# EAGLE schematic nixiRemoteControlReceiver (EAGLE 7.2.0)
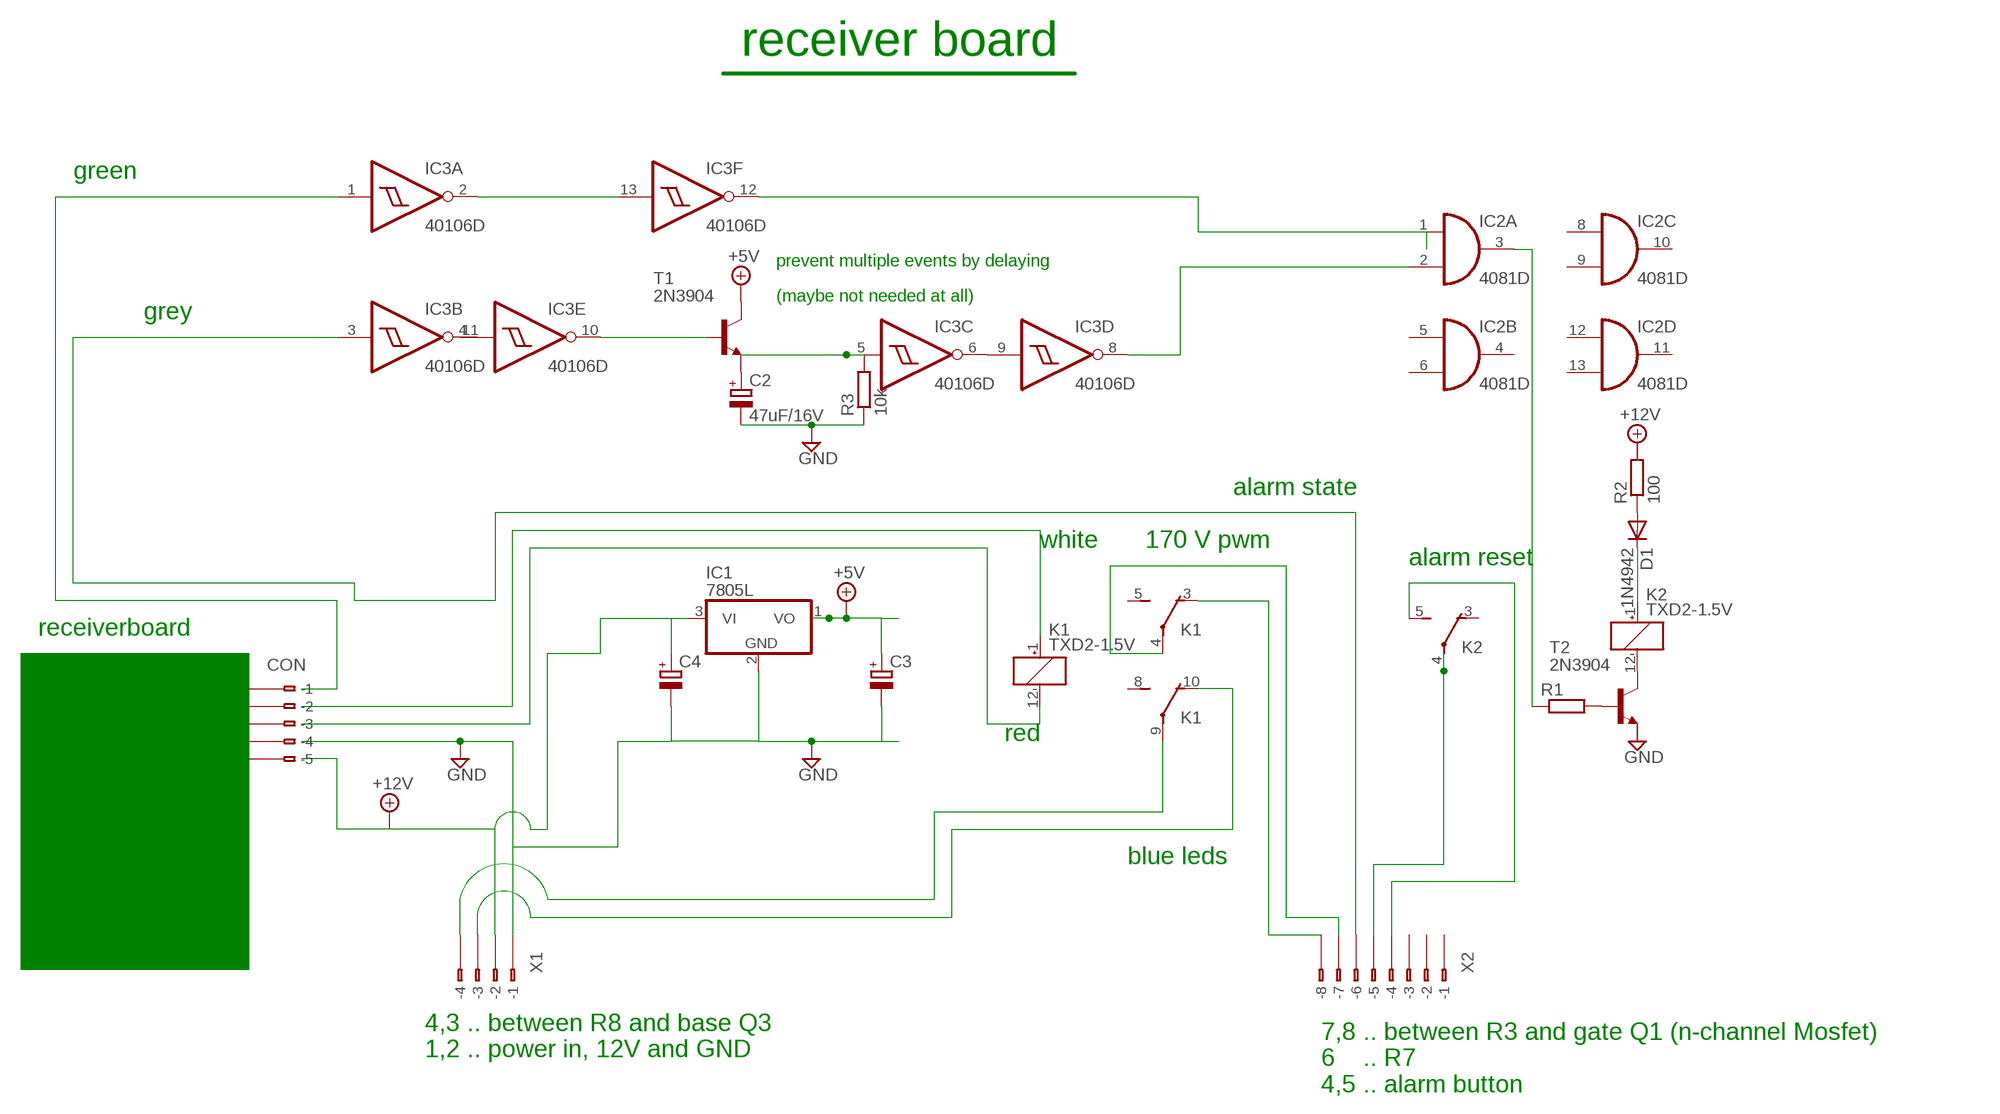
[diagram p0: schematic, sheet 1]

## Parts
C2  47uF/16V  CPOL-EUE10-20  [EB20D]
C3  CPOL-EUE10-20  [EB20D]
C4  CPOL-EUE10-20  [EB20D]
CON  233-105  [233-105]
D1  1N4942  [DO41-10]
IC1  7805L  [TO92]
IC2  4081D  [SO14]
IC3  40106D  [SO14]
K1  TXD2-1.5V  [TXD2]
K2  TXD2-1.5V  [TXD2]
R1  R-EU_0411/15  [0411/15]
R2  100  R-EU_0411/15  [0411/15]
R3  10k  R-EU_0411/15  [0411/15]
T1  2N3904  [TO92]
T2  2N3904  [TO92]
X1  233-104  [233-104]
X2  233-108  [233-108]

## Nets
+5V: C3.+ IC1.1(VO) T1.1(C)
+12V: C4.+ IC1.3(VI) R2.2 X1.B2(B-2)
GND: C2.- C3.- C4.- IC1.2(GND) R3.1 T2.3(E) X1.B1(B-1)
N$1: K1.10(O) X1.B3(B-3)
N$2: K1.9(P) X1.B4(B-4)
N$3: K1.3(O) X2.B8(B-8)
N$4: K1.4(P) X2.B7(B-7)
N$5: K2.12(_:-) T2.1(C)
N$6: R1.2 T2.2(B)
N$7: K2.5(S) X2.B4(B-4)
N$8: K2.4(P) X2.B5(B-5)
N$9: D1.A R2.1
N$10: D1.C K2.1(_:+)
N$11: C2.+ T1.3(E)
N$12: IC3.5(C:I) R3.2
N$13: K1.12(_:-)
N$14: K1.1(_:+)
N$15: IC3.1(A:I)
N$16: IC3.3(B:I) X2.B6(B-6)
N$17: IC3.6(C:O) IC3.9(D:I)
N$19: IC3.10(E:O) T1.2(B)
N$21: IC2.2(A:I1) IC3.8(D:O)
N$22: IC2.3(A:O) R1.1
N$23: IC3.12(F:O)
N$24: IC3.2(A:O) IC3.13(F:I)
Unconnected: CON.A1(-1) CON.A2(-2) CON.A3(-3) CON.A4(-4) CON.A5(-5) CON.B1(B-1) CON.B2(B-2) CON.B3(B-3) CON.B4(B-4) CON.B5(B-5) IC2.1(A:I0) IC2.4(B:O) IC2.5(B:I0) IC2.6(B:I1) IC2.8(C:I0) IC2.9(C:I1) IC2.10(C:O) IC2.11(D:O) IC2.12(D:I0) IC2.13(D:I1) IC3.4(B:O) IC3.11(E:I) K1.5(S) K1.8(S) K2.3(O) K2.8(S) K2.9(P) K2.10(O) X1.A1(-1) X1.A2(-2) X1.A3(-3) X1.A4(-4) X2.A1(-1) X2.A2(-2) X2.A3(-3) X2.A4(-4) X2.A5(-5) X2.A6(-6) X2.A7(-7) X2.A8(-8) X2.B1(B-1) X2.B2(B-2) X2.B3(B-3)

## Notes on the sheet
- receiver board
- green
- prevent multiple events by delaying
- (maybe not needed at all)
- grey
- alarm state
- white | 170 V pwm
- alarm reset
- receiverboard
- red
- blue leds
- 4,3 .. between R8 and base Q3
  1,2 .. power in, 12V and GND
- 7,8 .. between R3 and gate Q1 (n-channel Mosfet)
  6    .. R7
  4,5 .. alarm button

## Power pins joined to a net without a drawn wire
VDD: IC2.14(P:VDD) IC3.14(P:VDD)
VSS: IC2.7(P:VSS) IC3.7(P:VSS)

## Library data of the parts
C2-C4 = resistor:CPOL-EU: POLARIZED CAPACITOR, European symbol
CON = con-wago:233-105: WAGO Cage Clamp; MPN: 233-105; OC_FARNELL: unknown; OC_NEWARK: 28K9047
D1 = diode:1N4942: DIODE 1.0 A, 200 V, 150 ns
IC1 = linear:78*: Positive VOLTAGE REGULATOR Source: http://cache.national.com/ds/LM/LM78L05.pdf http://www.fairchildsemi.com/ds/LM/LM7805.pdf
IC2 = 40xx:4081: Quad 2-input AND
IC3 = 40xx:40106: Hex SCHMITT TRIGGER
K1 K2 = relay:TX?-*: TX Relais NAiS TX-D RELAYS HIGH INSULATION Conforming to the supplementary insulation class of EN Standards (EN41003) Source: http://www.mew-europe.com/.. en_ds_61022_0007.pdf TX-S RELAYS SMALL POLARIZED RELAY WITH HIGH SENSITIVITY 50mW Source: http://www.mew-europe.com/.. en_ds_61022_0022.pdf; OC_FARNELL: unknown; OC_NEWARK: unknown
R1-R3 = resistor:R-EU_: RESISTOR, European symbol
T1 T2 = transistor:2N3904: NPN TRANSISTOR
X1 = con-wago:233-104: WAGO Cage Clamp; MPN: 233-104; OC_FARNELL: unknown; OC_NEWARK: 28K9046
X2 = con-wago:233-108: WAGO Cage Clamp; MPN: 233-108; OC_FARNELL: unknown; OC_NEWARK: 28K9050